# Altium schematic sheet 02-USER_IO.SchDoc
size Tabloid; DocumentNumber: 1; SheetNumber: 2; SheetTotal: 15
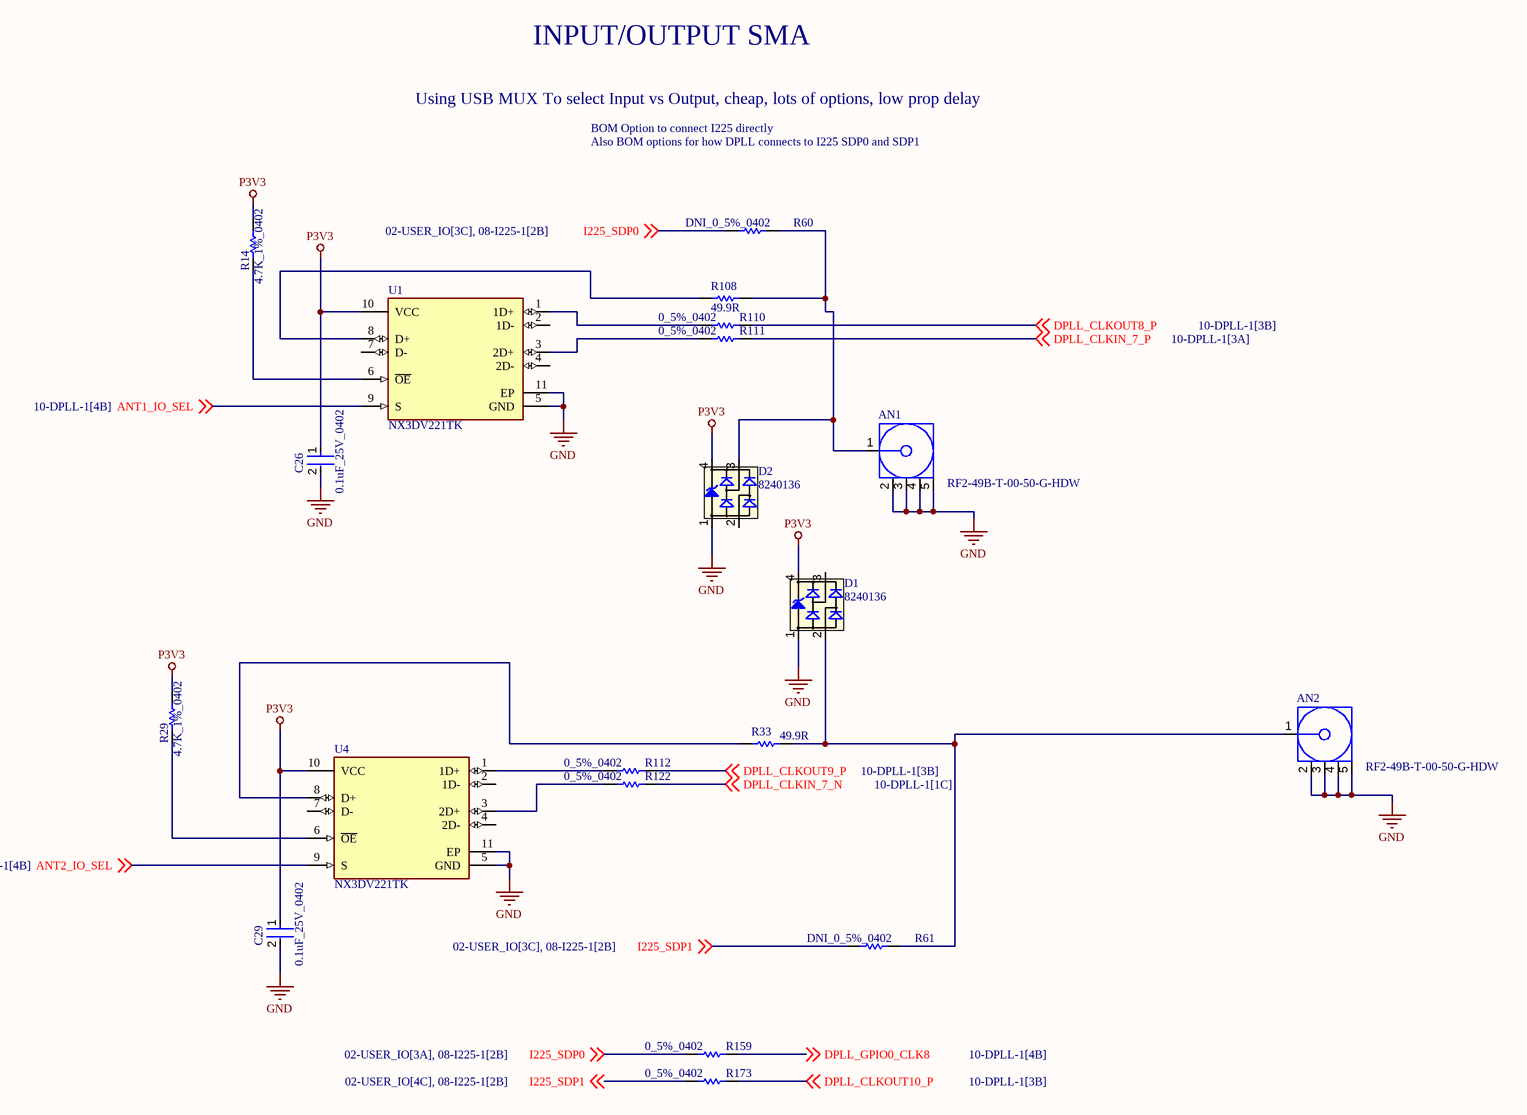
[diagram p0: 02-USER_IO.SchDoc]

## Parts
AN1  RF2-49B-T-00-50-G-HDW  [AMPH-901-143-6RFX_V]
AN2  RF2-49B-T-00-50-G-HDW  [AMPH-901-143-6RFX_V]
C26  0.1uF_25V_0402  [FP-0402-L_1_0_1-W_0_5_0_1-IPC_C]
C29  0.1uF_25V_0402  [FP-0402-L_1_0_1-W_0_5_0_1-IPC_C]
D1  8240136  [SOT143-4L]
D2  8240136  [SOT143-4L]
R14  4.7K_1%_0402  [RESC1005X40X25NL10T10]
R29  4.7K_1%_0402  [RESC1005X40X25NL10T10]
R33  49.9R  [RESC1608X55X25NL10T15]
R60  DNI_0_5%_0402  [RESC1005X40X25LL10T10]  (no BOM)
R61  DNI_0_5%_0402  [RESC1005X40X25LL10T10]  (no BOM)
R108  49.9R  [RESC1608X55X25NL10T15]
R110  0_5%_0402  [RESC1005X40X25LL10T10]
R111  0_5%_0402  [RESC1005X40X25LL10T10]
R112  0_5%_0402  [RESC1005X40X25LL10T10]
R122  0_5%_0402  [RESC1005X40X25LL10T10]
R159  0_5%_0402  [RESC1005X40X25LL10T10]
R173  0_5%_0402  [RESC1005X40X25LL10T10]
U1  NX3DV221TK  [FP-SOT650-2-MFG]
U4  NX3DV221TK  [FP-SOT650-2-MFG]

## Nets
GND: AN1.2 AN1.3 AN1.4 AN1.5 AN2.2 AN2.3 AN2.4 AN2.5 C26.2 C29.2 D1.1(GND) D2.1(GND) U1.5(GND) U1.11(EP) U4.5(GND) U4.11(EP)
P3V3: C26.1 C29.1 D1.4(VDD) D2.4(VDD) R14.1 R29.1 U1.10(VCC) U4.10(VCC)
ANT1_IO_SEL: U1.9(S) ; off-sheet ANT1_IO_SEL
ANT2_IO_SEL: U4.9(S) ; off-sheet ANT2_IO_SEL
DPLL_CLKIN_7_N: R122.2 ; off-sheet DPLL_CLKIN_7_N
DPLL_CLKIN_7_P: R111.2 ; off-sheet DPLL_CLKIN_7_P
DPLL_CLKOUT8_P: R110.2 ; off-sheet DPLL_CLKOUT8_P
DPLL_CLKOUT9_P: R112.2 ; off-sheet DPLL_CLKOUT9_P
DPLL_CLKOUT10_P: R173.2 ; off-sheet DPLL_CLKOUT10_P
DPLL_GPIO0_CLK8: R159.2 ; off-sheet DPLL_GPIO0_CLK8
I225_SDP0: R60.1 R159.1 ; off-sheet I225_SDP0
I225_SDP1: R61.1 R173.1 ; off-sheet I225_SDP1
NetAN1_1: AN1.1 D2.3(I/O2) R60.2 R108.1
NetAN2_1: AN2.1 D1.2(I/O1) R33.2 R61.2
NetR14_2: R14.2 U1.6(~{OE})
NetR29_2: R29.2 U4.6(~{OE})
NetR33_1: R33.1 U4.8(D+)
NetR108_2: R108.2 U1.8(D+)
NetR110_1: R110.1 U1.1(1D+)
NetR111_1: R111.1 U1.3(2D+)
NetR112_1: R112.1 U4.1(1D+)
NetR122_1: R122.1 U4.3(2D+)

Not connected (* = marked no-connect by the designer): D1 3(I/O2); D2 2(I/O1); U1 2(1D-) 4(2D-) 7(D-); U4 2(1D-) 4(2D-) 7(D-)

## Notes on the sheet
- INPUT/OUTPUT SMA
- Using USB MUX To select Input vs Output, cheap, lots of options, low prop delay
- BOM Option to connect I225 directly
- Also BOM options for how DPLL connects to I225 SDP0 and SDP1
- SHEET
- REV
- timingcard.com <http://timingcard.com>
- DATE
- OF

## Library data of the parts
AN1 AN2 = CMP-2000-05705-1: Coaxial connector, 50 Ohm, -65 to 165 degC, 5-Pin THD, RoHS, Bulk; Manufacturer: Amphenol; Catalog Drawings: 901-143-6RFXMountingHole; 3D Model: 901-143-6RFX.igs; Body Material: Brass; Connector Type: Jack,FemaleSocket; Shield Termination: Solder; Other Names: 901-143-6-RFX9011436RFXARFX1232; Online Catalog: SMA,RFX; Frequency - Max: 18GHz; Body Finish: Gold; Dielectric Material: Polytetrafluoroethylene(PTFE); Center Contact Material: BerylliumCopper; Impedance: 50Ohm; Connector Style: SMA; Mounting Technology: ThroughHole; Mounting Type: ThroughHole,RightAngle; Cable Group: -; Series: -; Package Description: 5-Pin Through Hole Device, Body 7 x 7 mm, Pitch 2.54 mm; Package Reference: 901-143-6RFX; Voltage Rating: -; Standard Package: 1; Fastening Type: Threaded; Housing Color: Gold; Datasheet URL: http://www.amphenolrf.com/downloads/dl/file/id/2712/product/3102/901_143_6rfx_customer_drawing.pdf; Family: CoaxialConnectors(RF); Contact Termination: Solder; Manufacturer URL: http://www.amphenol.com/; Operating Temperature: -65°C~165°C; Category: Connectors,Interconnects; Packaging: Bulk; Features: -; Center Contact Plating: Gold; Datasheet Version: Rev. C, 06/2010; Ingress Protection: -
C26 C29 = CMP-2008-02519-2: General Purpose Ceramic Capacitor, 0402, 100nF, 10%, X7R, 15%, 25V; Package Quantity: 1; Capacitance: 100nF; Min Operating Temperature: -55°C; Voltage: 25V; Voltage Rating: 25V; Construction: Flat; Max Operating Temperature: 125°C; Radiation Hardening: No; Depth: 0.5mm; Thickness: 0.022inch; Voltage Rating (DC): 25V; Number of Pins: 2; Lead Free: Lead Free; Series: -; REACH SVHC: No SVHC; Length: 1mm; Dielectric: X7R; RoHS Compliant: Yes; Mount: Surface Mount; Packaging: Tape and Reel; Case/Package: 0402; Case Code (Imperial): 0402; Termination: SMD/SMT; Width: 0.02inch; Case Code (Metric): 1005; Tolerance: 10%
D1 D2 = CMP-1486-00002-1: TVS Diode WE-TVS-HS, VRWM=3.3V; Manufacturer: Wuerth Elektronik; Reverse Stand Off Voltage: 3.3V; PartNumber: 8240136; ComponentLink1Description: Manufacturer URL; PackageReference: SOT143-4L; ComponentLink1URL: http://www.we-online.com; ComponentLink2Description: Datasheet; ComponentLink2URL: http://katalog.we-online.de/kataloge/eisos/media/pdf/8240136.pdf
R14 R29 = CMP-2002-05217-1: Manufacturer: Bourns; Part Number: CR0402-FX-4701GLF
R33 R108 = CMP-1659-00036-1: General Purpose Chip Resistor, 49.9 Ohm, +/- 1%, -55 to 155 degC, 0603 (1608 Metric), RoHS, Tape and Reel; Max Supply Voltage: 3.63 V; Case\Package: LQFP; Interface: SPI; Min Supply Voltage: 2.97 V; PackageReference: 0603; Packaging: Tray; ComponentLink2Description: Datasheet; ComponentLink1Description: Manufacturer URL; ComponentLink2URL: https://datasheet.ciiva.com/11808/0900766b80f96399-11808223.pdf; RoHSCompliant: true; Max Operating Temperature: 85 degC; ComponentLink1URL: http://www.yageo.com/; PackageDescription: 2-Pin Surface Mount Device, Body 1.6 x 0.8 mm; DatasheetVersion: Rev. 4, 04/2009; Min Operating Temperature: -40 degC; Package Quantity: 250; Pins: 48
R60 R61 R110-R112 R122 R159 R173 = CMP-2002-04569-1: Manufacturer: KOA Speer; Part Number: RK73Z1ETTP
U1 U4 = CMP-10103-000005-1: USB Switch IC 1 Channel 10-HVSON (3x3); RoHS Compliant: Yes